# EAGLE design PR5005V1.3 (EAGLE 6.4)
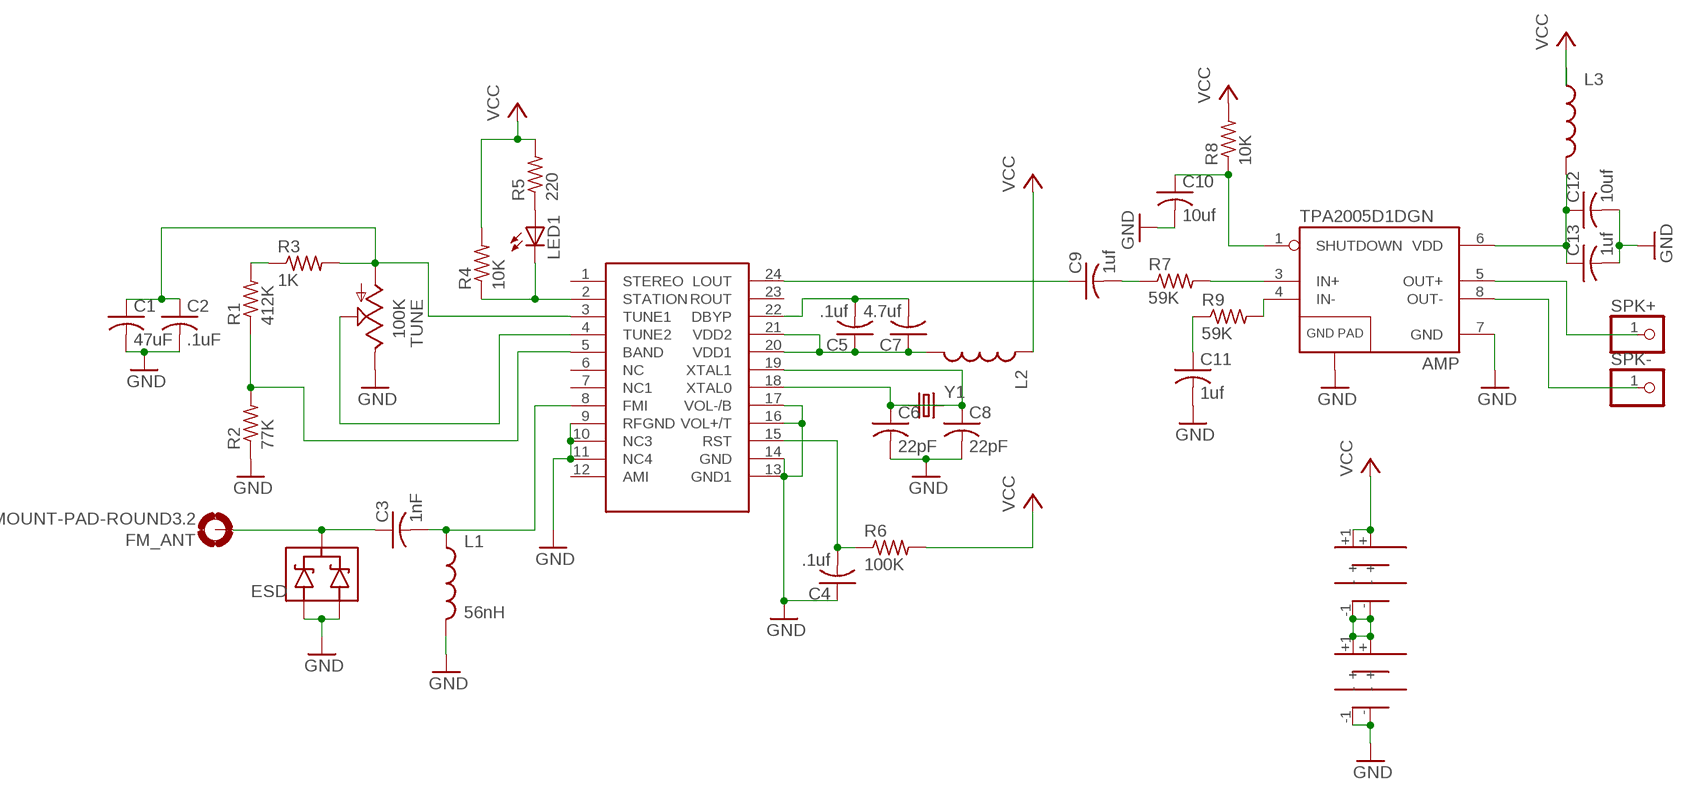
[diagram p0: schematic, sheet 1]

## Parts
AMP  TPA2005D1DGN  [POWER-SOP8]
C1  47uF  C-USC0603  [C0603]
C2  .1uF  C-USC0603  [C0603]
C3  1nF  C-USC0603  [C0603]
C4  .1uf  C-USC0603  [C0603]
C5  .1uf  C-USC0603  [C0603]
C6  22pF  C-USC0603  [C0603]
C7  4.7uf  C-USC0603  [C0603]
C8  22pF  C-USC0603  [C0603]
C9  1uf  C-USC0603  [C0603]
C10  10uf  C-USC0603  [C0603]
C11  1uf  C-USC0603  [C0603]
C12  10uf  C-USC0603  [C0603]
C13  1uf  C-USC0603  [C0603]
ESD  MMBZ27VCLT1  [SOT23-3]
FM_ANT  MOUNT-PAD-ROUND3.2  [3,2-PAD]
L1  56nH  INDUCTOR0603  [0603]
L2  INDUCTOR0603  [0603]
L3  INDUCTOR0603  [0603]
LED1  LEDCHIP-LED0603  [CHIP-LED0603]
R1  412K  R-US_R0603  [R0603]
R2  77K  R-US_R0603  [R0603]
R3  1K  R-US_R0603  [R0603]
R4  10K  R-US_R0603  [R0603]
R5  220  R-US_R0603  [R0603]
R6  100K  R-US_R0603  [R0603]
R7  59K  R-US_R0603  [R0603]
R8  10K  R-US_R0603  [R0603]
R9  59K  R-US_R0603  [R0603]
SI1  SI4831-SSOP-24  [SI4831-SSOP-24]
SPK+  PINHD-1X1  [1X01]
SPK-  PINHD-1X1  [1X01]
TUNE  100K  TRIM  [6MM]
U$1  MPD-BK-92-AA-CLIP  [MPD-BK-92-AA-CLIP]
U$2  MPD-BK-92-AA-CLIP  [MPD-BK-92-AA-CLIP]
Y1  CRYSTAL32-SMD  [CRYSTAL-32KHZ-SMD]

## Nets
GND: AMP.7(GND) AMP.9(GND) C1.2 C2.2 C4.1 C6.2 C8.2 C10.2 C11.2 C12.2 C13.2 ESD.1(A1) ESD.2(A2) L1.2 R2.1 SI1.9(RFGND) SI1.10(NC3) SI1.11(NC4) SI1.13(GND1) SI1.14(GND) SI1.16(VOL+/T) SI1.17(VOL-/B) TUNE.E U$2.- U$2.-1(-)
N$1: AMP.3(IN+) R7.2
N$2: AMP.4(IN-) R9.2
N$3: C11.1 R9.1
N$4: C9.2 R7.1
N$5: C9.1 SI1.24(LOUT)
N$6: C5.2 C7.2 SI1.22(DBYP)
N$7: C8.1 SI1.19(XTAL1) Y1.X1
N$8: C4.2 R6.1 SI1.15(RST)
N$9: LED1.C R4.1 SI1.2(STATION)
N$10: C6.1 SI1.18(XTAL0) Y1.X2
N$11: LED1.A R5.1
N$12: SI1.4(TUNE2) TUNE.S
N$13: R1.1 R2.2 SI1.5(BAND)
N$14: U$1.- U$1.-1(-) U$2.+ U$2.+1(+)
N$15: C3.2 L1.1 SI1.8(FMI)
N$16: C5.1 C7.1 L2.2 SI1.20(VDD1) SI1.21(VDD2)
N$17: AMP.6(VDD) C12.1 C13.1 L3.2
N$18: AMP.1(SHUTDOWN) C10.1 R8.1
N$19: C3.1 ESD.3(C) FM_ANT.B3,2(MOUNT)
N$20: R1.2 R3.1
N$21: C1.1 C2.1 R3.2 SI1.3(TUNE1) TUNE.A
N$23: AMP.5(OUT+) SPK+.1
N$24: AMP.8(OUT-) SPK-.1
VCC: L2.1 L3.1 R4.2 R5.2 R6.2 R8.2 U$1.+ U$1.+1(+)
Unconnected: SI1.1(STEREO) SI1.6(NC) SI1.7(NC1) SI1.12(AMI) SI1.23(ROUT)

## Library data of the parts
AMP = SparkFun-AnalogIC:TPA2005D1: 1.4W MONO CLASS-D AUDIO POWER AMPLIFIER The TPA2005D1 is a 1.4-W high efficiency filter-free class-D audio power amplifier in a BGA, QFN, or MSOP package that requires only three external components. Datasheet: http://focus.ti.com/lit/ds/symlink/tpa2005d1.pdf 1.4 W Into 8 ? From a 5V Supply at THD = 10% (Typ) Maximum Battery Life and Minimum Heat Efficiency With an 8-? Speaker: 84% at 400 mW, 79% at 100 mW 2.8-mA Quiescent Current 0.5-mA Shutdown Current Ideal for Wireless or Cellular Handsets and PDAs Capable of Driving an 8-? Speaker (2.5 V ? VDD ? 5.5 V) and a 4-? Speaker (2.5 V ? VDD ? 4.2 V) Only Three External Components Optimized PWM Output Stage Eliminates LC Output Filter Internally Generated 250-kHz Switching Frequency Eliminates Capacitor and Resistor Improved PSRR (-71 dB at 217 Hz) and Wide Supply Voltage (2.5 V to 5.5 V) Eliminates Need for a Voltage Regulator Fully Differential Design Reduces RF Rectification and Eliminates Bypass Capacitor Improved CMRR Eliminates Two Input Coupling Capacitors
C1-C13 = resistor:C-US: CAPACITOR, American symbol
ESD = SparkFun-DiscreteSemi:MMBZ27VCLT1: 40W Zener-diode transient voltage suppressor (ESD protection)
FM_ANT = holes:MOUNT-PAD-ROUND: MOUNTING PAD, round
L1-L3 = SparkFun-Passives:INDUCTOR: Inductors Basic Inductor/Choke - 0603 and 1206. Footprints are not proven and vary greatly between part numbers.
LED1 = adafruit:LED: LED OSRAM: - CHIPLED LG R971, LG N971, LY N971, LG Q971, LY Q971, LO R971, LY R971 LH N974, LH R974 LS Q976, LO Q976, LY Q976 LO Q996 - Hyper CHIPLED LW Q18S LB Q993, LB Q99A, LB R99A - SideLED LS A670, LO A670, LY A670, LG A670, LP A670 LB A673, LV A673, LT A673, LW A673 LH A674 LY A675 LS A676, LA A676, LO A676, LY A676, LW A676 LS A679, LY A679, LG A679 - Hyper Micro SIDELED® LS Y876, LA Y876, LO Y876, LY Y876 LT Y87S - SmartLED LW L88C, LW L88S LB L89C, LB L89S, LG L890 LS L89K, LO L89K, LY L89K LS L896, LA L896, LO L896, LY L896 - TOPLED LS T670, LO T670, LY T670, LG T670, LP T670 LSG T670, LSP T670, LSY T670, LOP T670, LYG T670 LG T671, LOG T671, LSG T671 LB T673, LV T673, LT T673, LW T673 LH T674 LS T676, LA T676, LO T676, LY T676, LB T676, LH T676, LSB T676, LW T676 LB T67C, LV T67C, LT T67C, LS T67K, LO T67K, LY T67K, LW E67C LS E67B, LA E67B, LO E67B, LY E67B, LB E67C, LV E67C, LT E67C LW T67C LS T679, LY T679, LG T679 LS T770, LO T770, LY T770, LG T770, LP T770 LB T773, LV T773, LT T773, LW T773 LH T774 LS E675, LA E675, LY E675, LS T675 LS T776, LA T776, LO T776, LY T776, LB T776 LHGB T686 LT T68C, LB T68C - Hyper Mini TOPLED® LB M676 - Mini TOPLED Santana® LG M470 LS M47K, LO M47K, LY M47K Source: http://www.osram.convergy.de/
R1-R9 = resistor:R-US_: RESISTOR, American symbol
SI1 = PublicRadioICs:SI4831-SSOP-24
SPK+ SPK- = adafruit:PINHD-1X1: Pin header 1x1 for 0.1" spacing With round pins
TUNE = adafruit:TRIM
U$1 U$2 = BatteryPack:MPD-BK-92-AA-CLIP
Y1 = SparkFun-FreqCtrl:CRYSTAL: Various standard crystals. Proven footprints. Spark Fun Electronics SKU : COM-00534

## Board
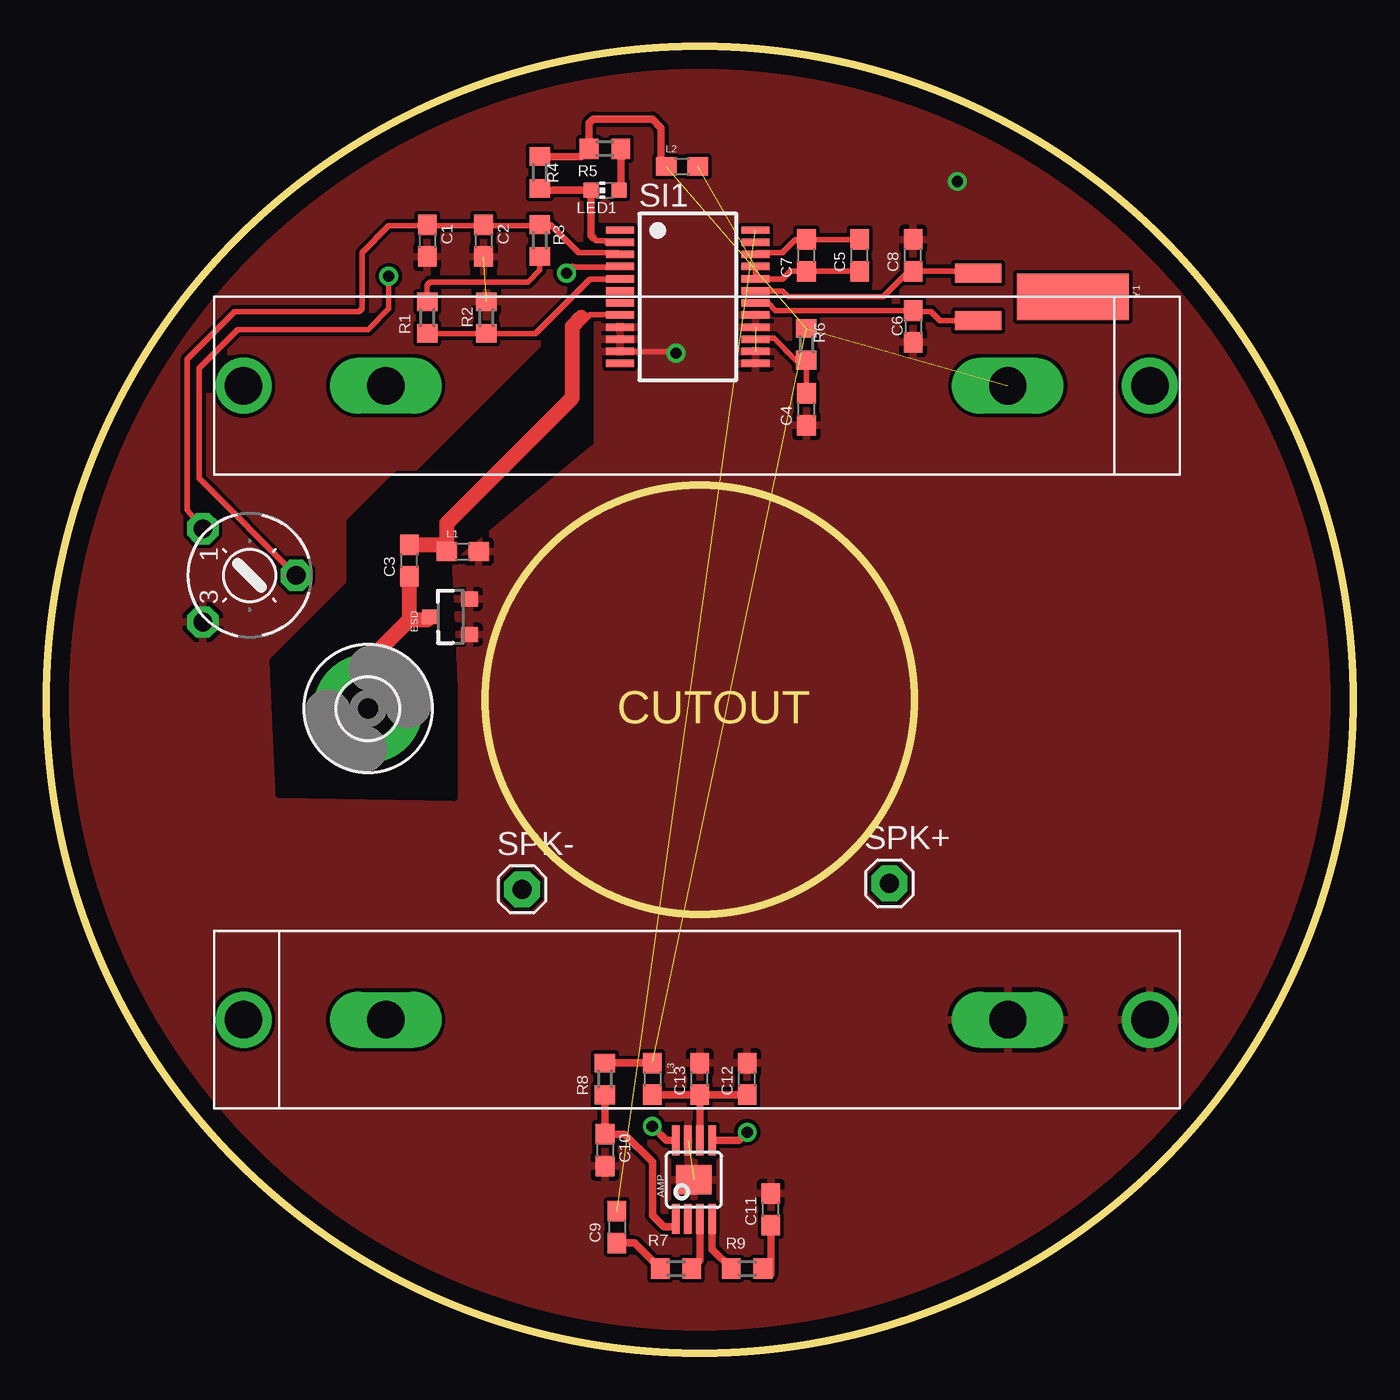
[diagram p1: board, top side]
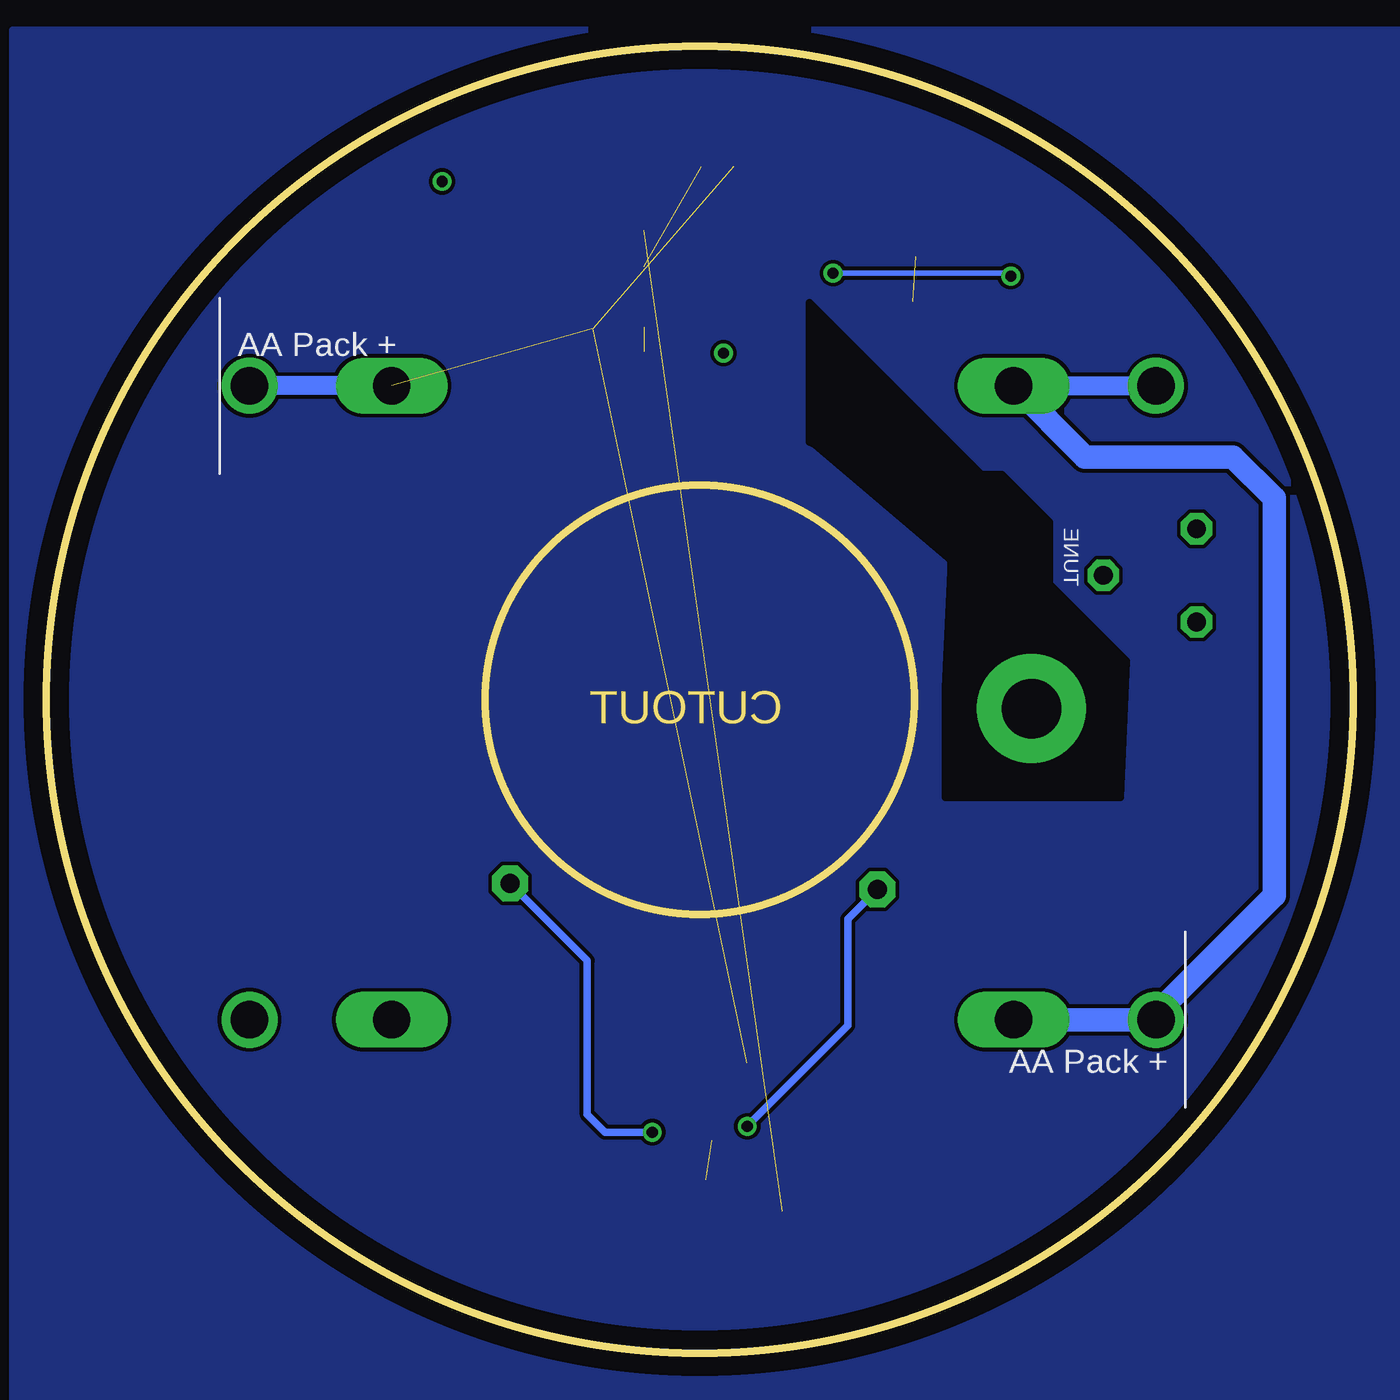
[diagram p2: board, bottom side, seen from below]

Size 70 x 70 mm. Coordinates in mm from the lower left corner, seen from the top.
Outline: circle at 35,35 radius 35
Copper layers (1*16): Top 0.035mm / dielectric 1.5mm / Bottom 0.035mm
Design rules "default": minimum track width 10mil, minimum drill 24mil, track to track 8mil, track to pad 8mil, pad to pad 8mil, via to via 8mil, smd to smd 8mil, copper to edge 40mil, drill to drill 8mil, minimum pad ring 10mil, minimum via ring 8mil, stop-mask expansion 4mil, vias tented up to drill 0mil, thermal gap 10mil
tRestrict: area 12.1,29.8 to 29.1,56.3
bRestrict: area 12.1,29.8 to 29.1,56.3
Milling: area 23.5,23.5 to 46.5,46.5

### Footprints (pad centres in the part's own frame; a part is rotated, then mirrored left to right if it is on the bottom)
POWER-SOP8 = smd 0.4 x 1.6: 1 -0.975,-2.1; 2 -0.325,-2.1; 3 0.325,-2.1; 4 0.975,-2.1; 5 0.975,2.1; 6 0.325,2.1; 7 -0.325,2.1; 8 -0.975,2.1 | smd 1.89 x 1.57: 9 0,0
C0603 = smd 1.1 x 1: 1 -0.85,0; 2 0.85,0
SOT23-3 = smd 0.8 x 0.9: 1 -0.95,-1; 2 0.95,-1; 3 0,1.1
3,2-PAD = drill 3.2 pad 5.842: B3,2 0,0
0603 = smd 1.1 x 1: 1 -0.85,0; 2 0.85,0
CHIP-LED0603 = smd 0.8 x 0.8: A 0,-0.75; C 0,0.75
R0603 = smd 1 x 1.1: 1 -0.85,0; 2 0.85,0
SI4831-SSOP-24 = smd 0.4 x 1.5: 1 -3.575,-3.625; 2 -2.925,-3.625; 3 -2.275,-3.625; 4 -1.625,-3.625; 5 -0.975,-3.625; 6 -0.325,-3.625; 7 0.325,-3.625; 8 0.975,-3.625; 9 1.625,-3.625; 10 2.275,-3.625; 11 2.925,-3.625; 12 3.575,-3.625; 13 3.575,3.625; 14 2.925,3.625; 15 2.275,3.625; 16 1.625,3.625; 17 0.975,3.625; 18 0.325,3.625; 19 -0.325,3.625; 20 -0.975,3.625; 21 -1.625,3.625; 22 -2.275,3.625; 23 -2.925,3.625; 24 -3.575,3.625
1X01 = drill 1.016 pad 1.93 octagon: 1 0,0
6MM = drill 1 pad 1.676 octagon: A -2.5,-2.5; E 2.5,-2.5; S 0,2.5
MPD-BK-92-AA-CLIP = drill 2 long: + 0,0; - 33.337,0 | drill 2: +1 -7.62,0; -1 40.958,0
CRYSTAL-32KHZ-SMD = smd 2.5 x 6: SHEILD 0,5.08 | smd 1 x 2.5: X1 -1.27,0; X2 1.27,0

### Placement (x,y rotation side)
AMP  34.68,9.28 0 top
C1  20.39,59.61 270 top
C2  23.41,59.61 270 top
C3  19.44,42.46 90 top
C4  40.71,50.56 90 top
C5  43.57,58.81 90 top
C6  46.43,55 270 top
C7  40.71,58.81 90 top
C8  46.43,58.81 90 top
C9  30.55,6.74 270 top
C10  29.92,10.87 270 top
C11  38.81,7.69 90 top
C12  37.54,14.68 90 top
C13  35,14.68 90 top
ESD  21.66,39.44 90 top
FM_ANT  17.22,34.52 0 top
L1  22.3,42.94 0 top
L2  34.05,63.57 0 top
L3  32.46,14.68 270 top
LED1  29.92,62.3 90 top
R1  20.39,55.48 90 top
R2  23.57,55.48 270 top
R3  26.43,59.61 90 top
R4  26.43,63.26 90 top
R5  29.92,64.53 180 top
R6  40.71,54.05 90 top
R7  33.73,4.52 0 top
R8  29.92,14.68 90 top
R9  37.54,4.52 180 top
SI1  34.36,56.59 270 top
SPK+  45.16,25.16 0 top
SPK-  25.47,24.84 0 top
TUNE  10.87,41.67 270 top
U$1  51.51,51.83 0 bottom
U$2  18.17,17.85 180 bottom
Y1  49.92,56.59 270 top

### Tracks (layer width: path | path; a pad name or v marks a point on that pad's centre or on a via)
GND  (via drill 0.6)  (3 unrouted)
  Top 0.305: SI1.11 33.64,53.66 v33.73,53.57
  other vias: 48.81,62.78
  pour Top: -3.1,70.88 71.83,70.88 71.83,-4.69 -3.1,-4.69
N$1
  Top 0.406: R7.2 35.01,4.95 AMP.3
N$2
  Top 0.406: R9.2 35.66,5.55 AMP.4
N$3
  Top 0.406: C11.1 38.81,4.2 38.49,4.52 R9.1
N$4
  Top 0.406: R7.1 31.51,5.89 C9.2
N$5  (1 unrouted)
N$6
  Top 0.305: C5.2 C7.2 40.14,59.66 39.45,58.97 38.1,58.97 SI1.22
N$7
  Top 0.305: Y1.X1 49.82,57.96 C8.1 46.21,57.96 44.84,56.59 39.76,56.59 39.45,56.91 38,56.91 SI1.19
N$8
  Top 0.305: C4.2 R6.1 40.14,53.2 38.97,54.37 38.04,54.37 SI1.15
N$9
  Top 0.305: 29.28,59.76 29.44,59.61 29.92,59.61 30.08,59.45 30.67,59.45 SI1.2
  Top 0.406: R4.1 26.53,62.3 LED1.C 29.17,59.88 29.28,59.76
N$10
  Top 0.305: Y1.X2 47.86,55.32 47.38,55.8 46.49,55.8 C6.1 39.07,55.85 38.65,56.27 38,56.27 SI1.18
N$11
  Top 0.406: R5.1 30.77,62.4 LED1.A
N$12  (via drill 0.6)
  Top 0.305: 28.17,58.18 30.7,58.18 SI1.4 | v18.33,57.7 18.33,55.95 17.22,54.84 10.24,54.84 8.17,52.78 8.17,46.87 TUNE.S
  Top 0.406: v27.86,57.86 28.17,58.18
  Bottom 0.305: v27.86,57.86 18.49,57.86 v18.33,57.7
N$13
  Top 0.305: R1.1 R2.2 26.21,54.63 29.13,57.54 30.72,57.54 SI1.5
N$14
  Bottom 1.016: U$1.- U$1.-1
  Bottom 1.27: U$1.- 14.36,48.02 6.43,48.02 4.2,45.79 4.2,24.52 10.55,18.17 | 10.55,18.17 U$2.+1 | 10.55,18.17 10.87,17.85 U$2.+
N$15
  Top 0.305: 28.65,55.48 28.97,55.48 29.13,55.64 30.72,55.64 SI1.8
  Top 0.813: 28.65,55.48 28.17,55 28.17,51.19 21.45,44.47 L1.1 21.08,43.31 C3.2
N$16  (1 unrouted)
  Top 0.305: SI1.21 SI1.20 38.01,57.54 39.45,57.54 39.86,57.96 C7.1 C5.1
N$17
  Top 0.406: L3.2 C13.1 | C13.1 AMP.6 | C12.1 C13.1
N$18
  Top 0.406: R8.1 C10.1 30.97,11.72 32.46,10.23 32.46,7.38 33.1,6.74 33.73,6.74 33.73,7.16 AMP.1
N$19
  Top 0.813: FM_ANT.B3,2 17.22,37.06 19.44,39.29 | 19.44,39.29 C3.1 | 19.44,39.29 20.41,39.29 ESD.3
N$20
  Top 0.305: R1.2 20.39,57.22 20.55,57.38 25.79,57.38 26.43,58.02 R3.1
N$21
  Top 0.305: 26.32,60.4 23.47,60.4 C2.1 | 23.25,60.4 20.45,60.4 C1.1 | R3.2 27.01,60.46 28.49,58.97 30.63,58.97 SI1.3 | 20.34,60.4 18.33,60.4 16.9,58.97 16.9,55.95 16.74,55.8 10.08,55.8 7.54,53.26 7.54,45.16 TUNE.A
  Top 0.406: C2.1 23.25,60.4 | 26.32,60.4 R3.2 | 20.34,60.4 C1.1
N$22
  pour Bottom: -0.88,70.88 71.83,70.88 71.83,-4.37 -3.1,-4.37 -3.1,70.88
N$23  (via drill 0.6)
  Top 0.406: AMP.5 37.1,11.38 v37.54,11.82
  Bottom 0.406: v37.54,11.82 40.08,11.82 41.03,12.77 41.03,21.03 SPK+.1
N$24  (via drill 0.6)
  Top 0.406: AMP.8 33.22,11.38 v32.46,12.14
  Bottom 0.406: v32.46,12.14 27.06,17.54 27.06,23.25 SPK-.1
VCC  (3 unrouted)
  Top 0.406: R8.2 L3.1 | R4.2 28.65,64.11 R5.2 29.07,65.9 29.28,66.11 32.46,66.11 32.94,65.64 32.94,63.84 L2.1
  Bottom 1.016: U$1.+ U$1.+1

### Text on the board
Dimension: CUTOUT